# EAGLE schematic logger_lambda_new (EAGLE 6.6.0)
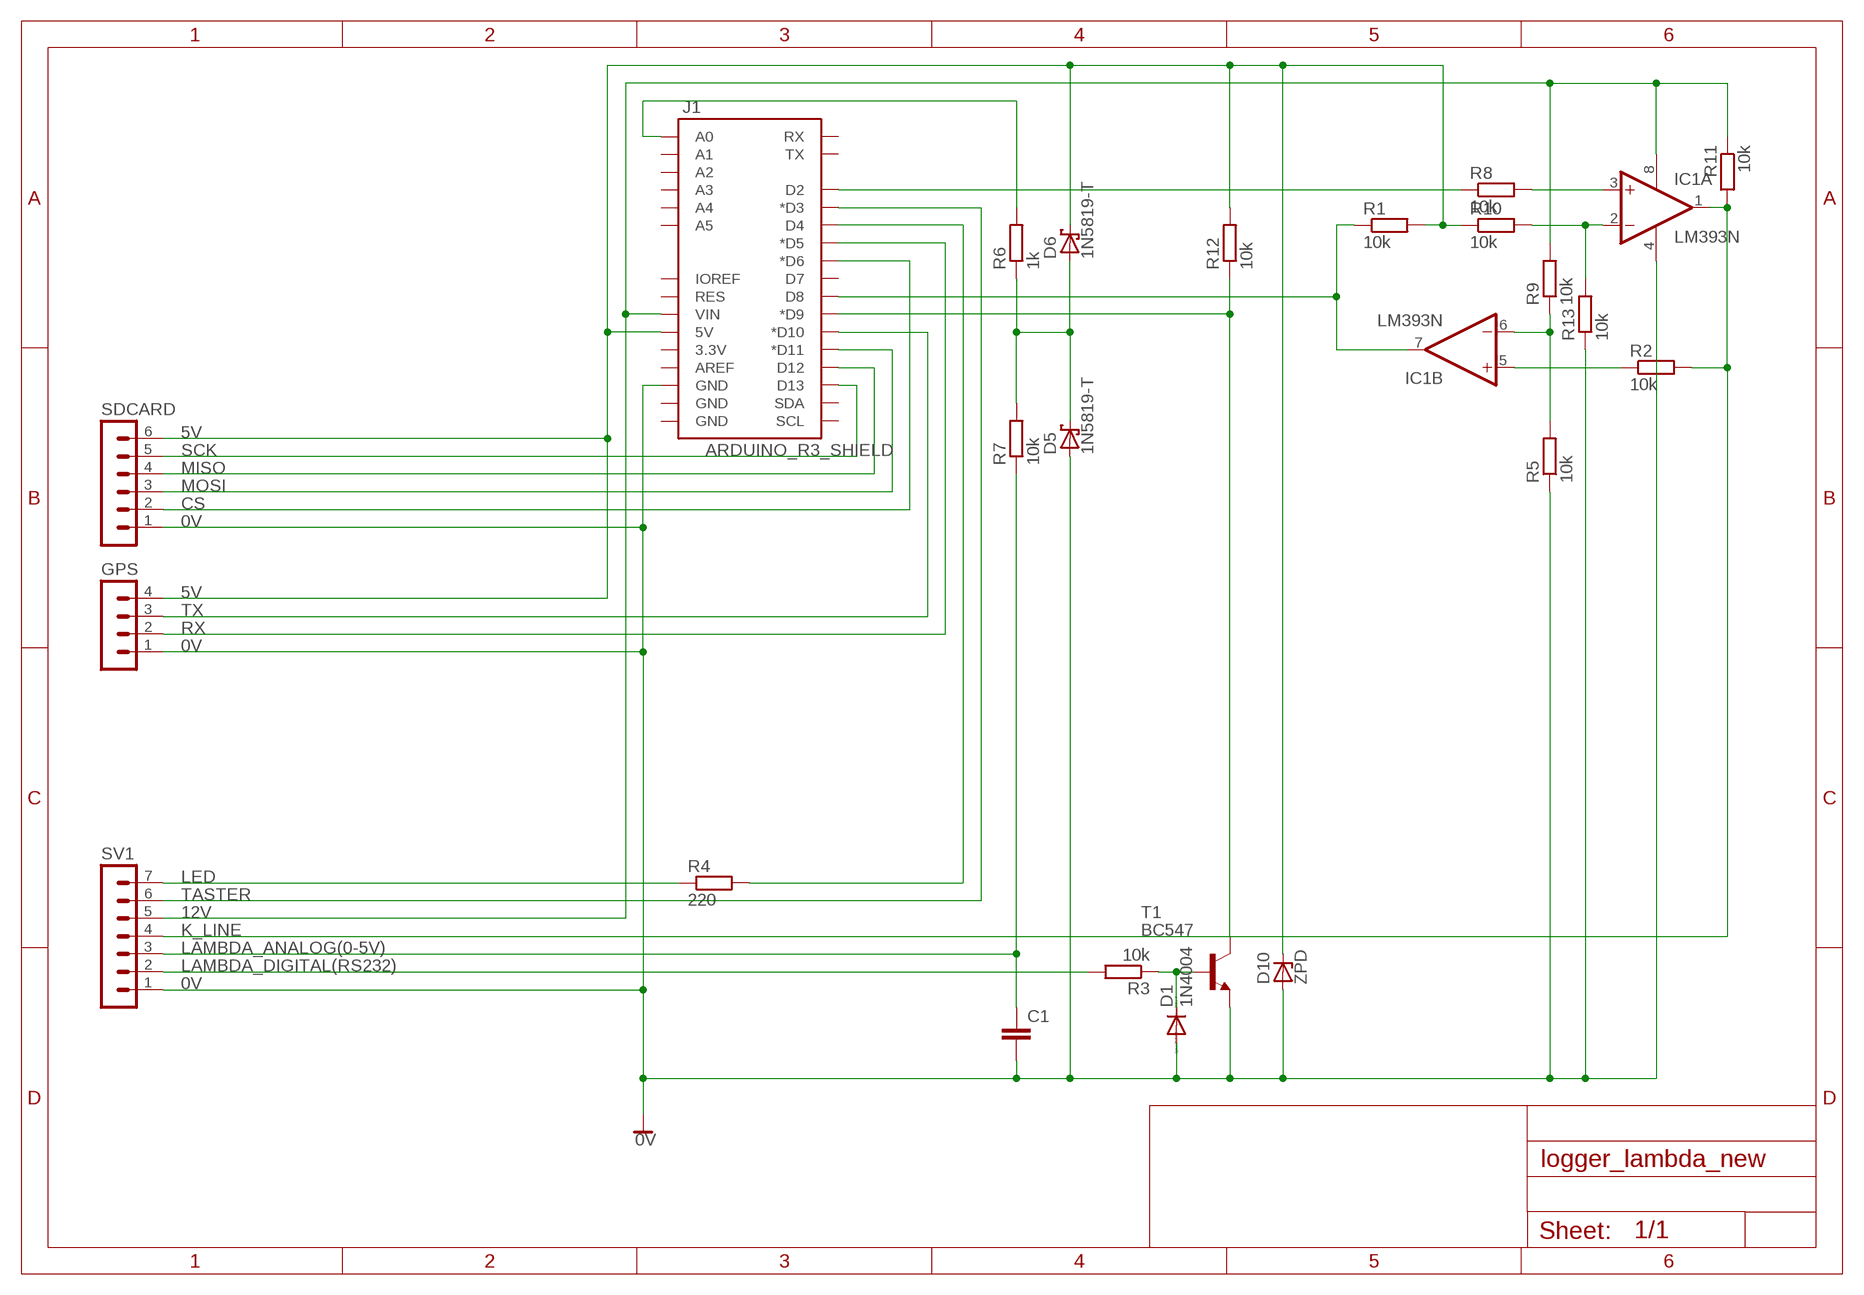
[diagram p0: schematic, sheet 1]

## Parts
C1  C2,5-3  [C2.5-3]
D1  1N4004  [DO41-10]
D5  1N5819-T  [DO41-7.6]
D6  1N5819-T  [DO41-7.6]
D10  ZPD  [DO35Z10]
GPS  MA04-1  [MA04-1]
IC1  LM393N  [DIL08]
J1  ARDUINO_R3_SHIELD  [UNO_R3_SHIELD]
R1  10k  R-EU_0207/7  [0207/7]
R2  10k  R-EU_0207/7  [0207/7]
R3  10k  R-EU_0207/7  [0207/7]
R4  220  R-EU_0207/7  [0207/7]
R5  10k  R-EU_0207/7  [0207/7]
R6  1k  R-EU_0207/7  [0207/7]
R7  10k  R-EU_0207/7  [0207/7]
R8  10k  R-EU_0207/7  [0207/7]
R9  10k  R-EU_0207/7  [0207/7]
R10  10k  R-EU_0207/7  [0207/7]
R11  10k  R-EU_0207/7  [0207/7]
R12  10k  R-EU_0207/7  [0207/7]
R13  10k  R-EU_0207/7  [0207/7]
SDCARD  MA06-1  [MA06-1]
SV1  MA07-1  [MA07-1]
T1  BC547  [TO92]

## Nets
0V: C1.2 D1.A D5.A D10.A GPS.1 IC1.4(P:V-) J1.GND@2(GND) R5.1 R13.1 SDCARD.1 SV1.1 T1.1(E)
5V: D6.C D10.C GPS.4 J1.5V R1.2 R10.1 R12.2 SDCARD.6
12V: IC1.8(P:V+) J1.VIN R9.2 R11.1 SV1.5
ANALOG_IN: D5.C D6.A J1.A0 R6.1 R6.2 R7.2
CS: J1.D6(*D6) SDCARD.2
DIGITAL_OUT: J1.D4
K_LINE: IC1.1(A:OUT) R2.2 R11.2 SV1.4
LAMBDA_ANALOG(0-5V): C1.1 R7.1 SV1.3
LAMBDA_DIGITAL(RS232): R3.2 SV1.2
LED: R4.1 R4.2 SV1.7
MISO: J1.D12 SDCARD.4
MOSI: J1.D11(*D11) SDCARD.3
N$1: D1.C R3.1 T1.2(B)
N$6: IC1.5(B:+IN) R2.1
N$7: IC1.6(B:-IN) R5.2 R9.1
N$9: IC1.3(A:+IN) R8.2
N$11: IC1.2(A:-IN) R10.2 R13.2
RX: GPS.2 J1.D5(*D5)
RX0: IC1.7(B:OUT) J1.D8 R1.1
RX1: J1.D9(*D9) R12.1 T1.3(C)
SCK: J1.D13 SDCARD.5
TASTER: J1.D3(*D3) SV1.6
TX: GPS.3 J1.D10(*D10)
TX0: J1.D2 R8.1
Unconnected: J1.3.3V J1.A1 J1.A2 J1.A3 J1.A4 J1.A5 J1.AREF J1.D7 J1.GND@0(GND) J1.GND@1(GND) J1.IOREF J1.RES J1.RX J1.SCL J1.SDA J1.TX

## Library data of the parts
C1 = capacitor-wima:C: CAPACITOR naming: grid - package width
D1 = diode:1N4004: DIODE general purpose rectifier, 1 A
D5 D6 = diode:1N581*: 1.0A SCHOTTKY BARRIER RECTIFIER Source: http://www.diodes.com/datasheets/ds23001.pdf
D10 = diode:ZPD: Z DIODE 500 mW
GPS = con-lstb:MA04-1: PIN HEADER; OC_FARNELL: unknown; OC_NEWARK: unknown
IC1 = linear:LM393: COMPARATOR
J1 = SparkFun-Boards:ARDUINO_R3_SHIELD: Shield form compatible with the Arduino Uno R3.
R1-R13 = rcl:R-EU_: RESISTOR, European symbol
SDCARD = con-lstb:MA06-1: PIN HEADER; OC_FARNELL: unknown; OC_NEWARK: unknown
SV1 = con-lstb:MA07-1: PIN HEADER; OC_FARNELL: unknown; OC_NEWARK: unknown
T1 = transistor:BC547: NPN TRANSISTOR